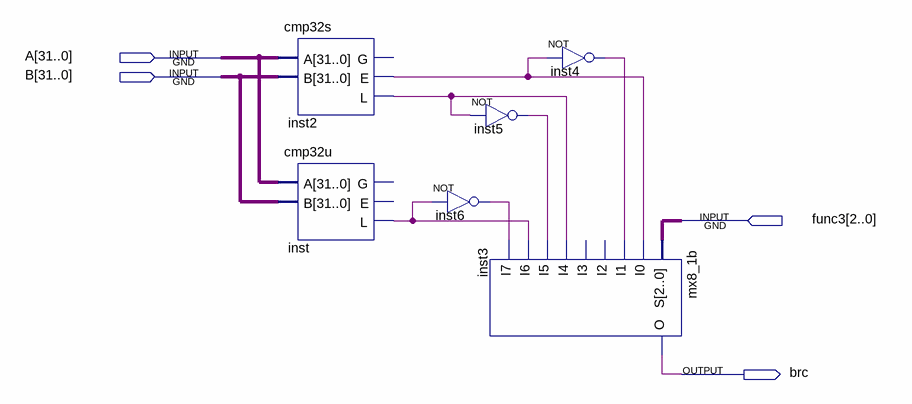
[diagram p0: schematic sheet]
// Quartus schematic branch_alu.bdf as structural Verilog: 6 symbols, 4 pins
module branch_alu (
  input  [31:0] A,
  input  [31:0] B,
  input  [2:0] func3,
  output brc
);

  wire inst2_e, inst2_l, inst4_out, inst5_out, inst6_out, inst_l;

  cmp32s inst2 (.A(A), .B(B), .E(inst2_e), .L(inst2_l));  // open: G
  cmp32u inst (.A(A), .B(B), .L(inst_l));  // open: G, E
  not inst6 (inst6_out, inst_l);
  not inst5 (inst5_out, inst2_l);
  mx8_1b inst3 (
    .S(func3), .I0(inst2_e), .I1(inst4_out), .I4(inst2_l), .I5(inst5_out), .I6(inst_l), .I7(inst6_out),
    .O(brc));  // open: I2, I3
  not inst4 (inst4_out, inst2_e);
endmodule
